# Altium schematic sheet ADC.SchDoc
size A4
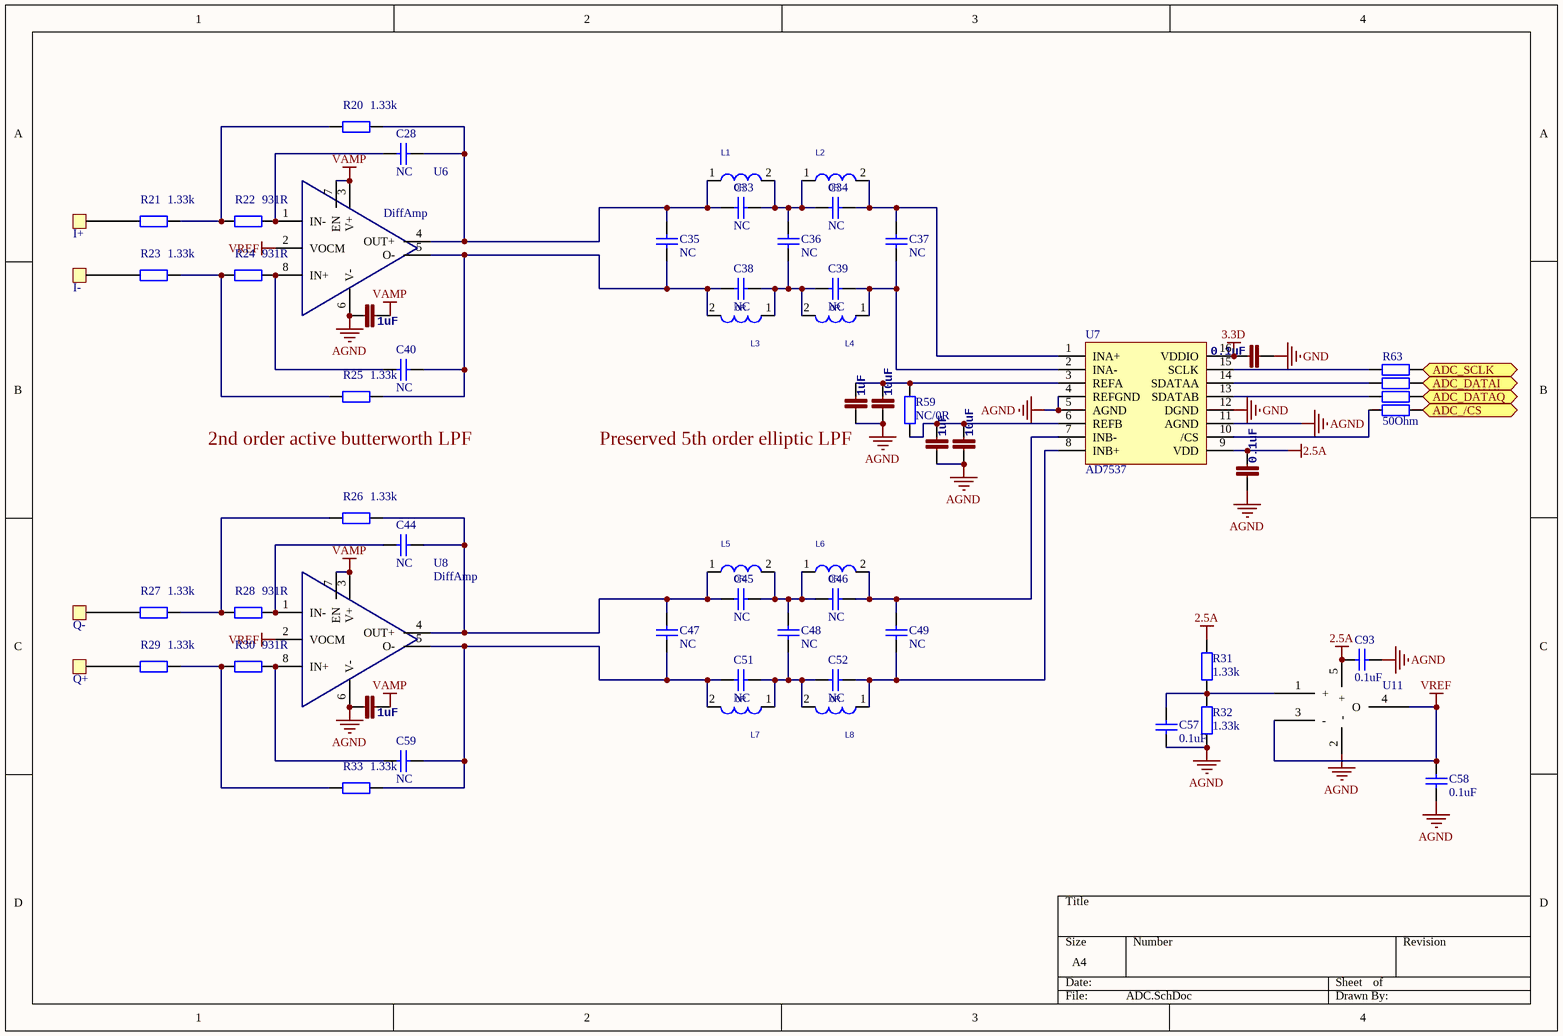
[diagram p0: ADC.SchDoc]

## Parts
C28  NC  [0402]
C29  0.1uF  [0402]
C30  0.1uF  [0603]
C31  10uF  [0603]
C32  1uF  [0805]
C33  NC  [0402]
C34  NC  [0402]
C35  NC  [0402]
C36  NC  [0402]
C37  NC  [0402]
C38  NC  [0402]
C39  NC  [0402]
C40  NC  [0402]
C41  1uF  [0603]
C43  10uF  [0805]
C44  NC  [0402]
C45  NC  [0402]
C46  NC  [0402]
C47  NC  [0402]
C48  NC  [0402]
C49  NC  [0402]
C51  NC  [0402]
C52  NC  [0402]
C57  0.1uF  [0402]
C58  0.1uF  [0402]
C59  NC  [0402]
C89  1uF  [0603]
C90  1uF  [0603]
C93  0.1uF  [0402]
I+  TestPad  [TestPad - 1mm]  (value not drawn)
I-  TestPad  [TestPad - 1mm]  (value not drawn)
L1  0R  [0402]
L2  0R  [0402]
L3  0R  [0402]
L4  0R  [0402]
L5  0R  [0402]
L6  0R  [0402]
L7  0R  [0402]
L8  0R  [0402]
Q+  TestPad  [TestPad - 1mm]  (value not drawn)
Q-  TestPad  [TestPad - 1mm]  (value not drawn)
R20  1.33k  [0402]
R21  1.33k  [0402]
R22  931R  [0402]
R23  1.33k  [0402]
R24  931R  [0402]
R25  1.33k  [0402]
R26  1.33k  [0402]
R27  1.33k  [0402]
R28  931R  [0402]
R29  1.33k  [0402]
R30  931R  [0402]
R31  1.33k  [0402]
R32  1.33k  [0402]
R33  1.33k  [0402]
R59  NC/0R  [0402]
R63  value 50Ohm  [0402X4]  (hidden comment: Res*4)
U6  DiffAmp  [MSOP8/VSSOP8]
U7  AD7537  [AD7357]
U8  DiffAmp  [MSOP8/VSSOP8]
U11  OP-SOT23  [SOT23-5]  (value not drawn)

## Ports
ADC_/CS, ADC_DATAI, ADC_DATAQ, ADC_SCLK

## Nets
2.5A: C30.1 C93.1 R31.1 U7.9(VDD) U11.5(+)
3.3D: C29.1 U7.16(VDDIO)
AGND: C30.2 C31.2 C32.2 C41.2 C43.2 C57.2 C58.2 C89.2 C90.2 C93.2 R32.2 U6.6(V-) U7.4(REFGND) U7.5(AGND) U7.11(AGND) U8.6(V-) U11.2(-)
GND: C29.2 U7.12(DGND)
VAMP: C89.1 C90.1 U6.3(V+) U6.7(EN) U8.3(V+) U8.7(EN)
VREF: C58.1 U6.2(VOCM) U8.2(VOCM) U11.3(-) U11.4(O)
ADC_/CS: R63.1 ; port ADC_/CS
ADC_DATAI: R63.3 ; port ADC_DATAI
ADC_DATAQ: R63.2 ; port ADC_DATAQ
ADC_SCLK: R63.4 ; port ADC_SCLK
NetC28_1: C28.1 C33.2 C35.2 L1.1 R20.1 U6.4(OUT+)
NetC28_2: C28.2 R22.1 U6.1(IN-)
NetC31_1: C31.1 C32.1 R59.1 U7.6(REFB)
NetC33_1: C33.1 C34.2 C36.2 L1.2 L2.1
NetC34_1: C34.1 C37.2 L2.2 U7.1(INA+)
NetC35_1: C35.1 C38.1 C40.1 L3.2 R25.1 U6.5(O-)
NetC36_1: C36.1 C38.2 C39.1 L3.1 L4.2
NetC37_1: C37.1 C39.2 L4.1 U7.2(INA-)
NetC40_2: C40.2 R24.1 U6.8(IN+)
NetC41_1: C41.1 C43.1 R59.2 U7.3(REFA)
NetC44_1: C44.1 C45.2 C47.2 L5.1 R26.1 U8.4(OUT+)
NetC44_2: C44.2 R28.1 U8.1(IN-)
NetC45_1: C45.1 C46.2 C48.2 L5.2 L6.1
NetC46_1: C46.1 C49.2 L6.2 U7.7(INB-)
NetC47_1: C47.1 C51.1 C59.1 L7.2 R33.1 U8.5(O-)
NetC48_1: C48.1 C51.2 C52.1 L7.1 L8.2
NetC49_1: C49.1 C52.2 L8.1 U7.8(INB+)
NetC57_1: C57.1 R31.2 R32.1 U11.1(+)
NetC59_2: C59.2 R30.1 U8.8(IN+)
NetI+_1: I+.1 R21.2
NetI-_1: I-.1 R23.2
NetQ+_1: Q+.1 R29.2
NetQ-_1: Q-.1 R27.2
NetR20_2: R20.2 R21.1 R22.2
NetR23_1: R23.1 R24.2 R25.2
NetR26_2: R26.2 R27.1 R28.2
NetR29_1: R29.1 R30.2 R33.2
NetR63_5: R63.5 U7.15(SCLK)
NetR63_6: R63.6 U7.14(SDATAA)
NetR63_7: R63.7 U7.13(SDATAB)
NetR63_8: R63.8 U7.10(/CS)

## Notes on the sheet
- (near R25) 2nd order active butterworth LPF
- (near R59) Preserved 5th order elliptic LPF

## Library data of the parts
C28 C33-C40 C44-C49 C51 C52 C57-C59 C93 = Cap: Capacitor; Published: 8-Jun-2000; LatestRevisionDate: 17-Jul-2002; LatestRevisionNote: Re-released for DXP Platform.; PackageReference: RAD-0.3; Publisher: Altium Limited; PackageDescription: Radial Cap, Thru-Hole; 2 Leads; 0.3 in Pin Spacing
C29-C32 C41 C43 C89 C90 = CAP0402-CAP: <b>Capacitor</b> / Standard 0603 ceramic capacitor, and 0.1" leaded capacitor.; PARTNO: CC0402ZRY5V7BB104
L1-L8 = L/2.5*2.0
R20-R33 R59 = Res2: Resistor; Value: 0Ohm; Published: 8-Jun-2000; LatestRevisionDate: 17-Jul-2002; LatestRevisionNote: Re-released for DXP Platform.; PackageReference: AXIAL-0.4; Publisher: Altium Limited; PackageDescription: Axial Device, Thru-Hole; 2 Leads; 0.4 in Pin Spacing
R63 = Res*4: Resistor; Published: 8-Jun-2000; LatestRevisionDate: 17-Jul-2002; LatestRevisionNote: Re-released for DXP Platform.; PackageReference: AXIAL-0.4; Publisher: Altium Limited; PackageDescription: Axial Device, Thru-Hole; 2 Leads; 0.4 in Pin Spacing